# Altium schematic sheet Microcontroller.SchDoc
size A2; Organization: Altium Limited; Address1: L3, 12a Rodborough Rd; Address2: Frenchs Forest; Address3: NSW; Address4: Australia 2086
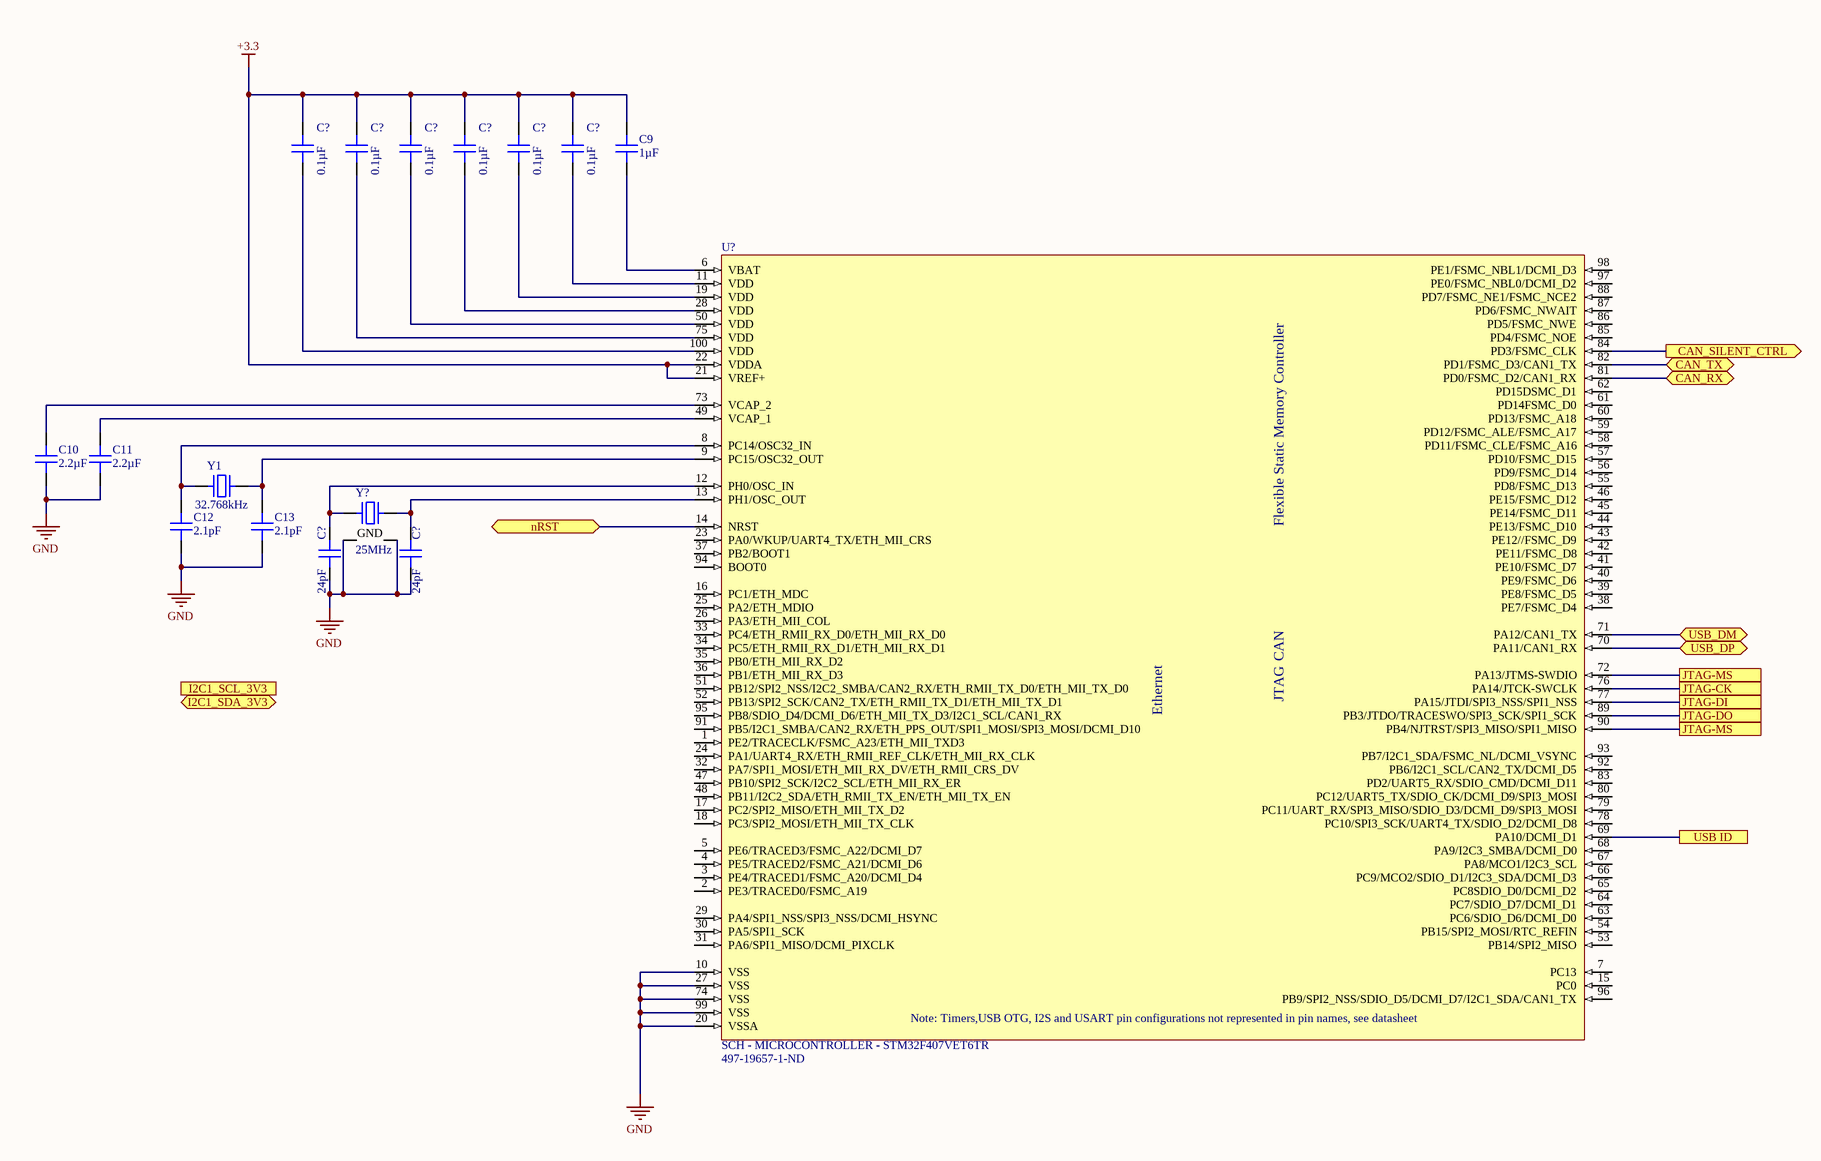
[diagram p0: Microcontroller.SchDoc]

## Parts
(Parts that share a designator on the sheet are numbered #1, #2 ... from top to bottom, then left to right.)
C9  1µF  [CAP 0603_1608]
C10  2.2µF  [CAP 0603_1608]
C11  2.2µF  [CAP 0603_1608]
C12  2.1pF  [CAP 0603_1608]
C13  2.1pF  [CAP 0603_1608]
C?#1  0.1µF  [CAP 0603_1608]
C?#2  0.1µF  [CAP 0603_1608]
C?#3  0.1µF  [CAP 0603_1608]
C?#4  0.1µF  [CAP 0603_1608]
C?#5  0.1µF  [CAP 0603_1608]
C?#6  0.1µF  [CAP 0603_1608]
C?#7  24pF  [CAP 0603_1608]
C?#8  24pF  [CAP 0603_1608]
U?  SCH - MICROCONTROLLER - STM32F407VET6TR  Supplier Part Number 1: 497-19657-1-ND  [PCB - LEADLESS - QFP - ST LQFP-100 14X14MM]
Y1  32.768kHz  [ABRACON ABS07]
Y?  25MHz  [EPSON TSX-3225]

## Ports
CAN_RX (bidir), CAN_SILENT_CTRL (out), CAN_TX (bidir), I2C1_SCL_3V3 (in), I2C1_SDA_3V3 (bidir), JTAG-CK, JTAG-DI, JTAG-DO, JTAG-MS, nRST (bidir), USB ID, USB_DM (bidir), USB_DP (bidir)

## Nets
+3.3: C9.2 C?#1.2 C?#2.2 C?#3.2 C?#4.2 C?#5.2 C?#6.2 U?.21(VREF+) U?.22(VDDA)
GND: C10.1 C11.1 C12.1 C13.1 C?#7.1 C?#8.1 U?.10(VSS) U?.20(VSSA) U?.27(VSS) U?.74(VSS) U?.99(VSS) Y?.2(GND) Y?.4(GND)
CAN_RX: U?.81(PD0/FSMC_D2/CAN1_RX) ; port CAN_RX
CAN_SILENT_CTRL: U?.84(PD3/FSMC_CLK) ; port CAN_SILENT_CTRL
CAN_TX: U?.82(PD1/FSMC_D3/CAN1_TX) ; port CAN_TX
JTAG-CK: U?.76(PA14/JTCK-SWCLK) ; port JTAG-CK
JTAG-DI: U?.77(PA15/JTDI/SPI3_NSS/SPI1_NSS) ; port JTAG-DI
JTAG-DO: U?.89(PB3/JTDO/TRACESWO/SPI3_SCK/SPI1_SCK) ; port JTAG-DO
JTAG-MS: U?.72(PA13/JTMS-SWDIO) U?.90(PB4/NJTRST/SPI3_MISO/SPI1_MISO) ; port JTAG-MS
nRST: U?.14(NRST) ; port nRST
USB ID: U?.69(PA10/DCMI_D1) ; port USB ID
USB_DM: U?.71(PA12/CAN1_TX) ; port USB_DM
USB_DP: U?.70(PA11/CAN1_RX) ; port USB_DP
NetC9_1: C9.1 U?.6(VBAT)
NetC10_2: C10.2 U?.73(VCAP_2)
NetC11_2: C11.2 U?.49(VCAP_1)
NetC12_2: C12.2 U?.8(PC14/OSC32_IN) Y1.1
NetC13_2: C13.2 U?.9(PC15/OSC32_OUT) Y1.2
NetC?#1_1: C?#1.1 U?.100(VDD)
NetC?#2_1: C?#2.1 U?.75(VDD)
NetC?#3_1: C?#3.1 U?.50(VDD)
NetC?#4_1: C?#4.1 U?.28(VDD)
NetC?#5_1: C?#5.1 U?.19(VDD)
NetC?#6_1: C?#6.1 U?.11(VDD)
NetC?#7_2: C?#7.2 U?.12(PH0/OSC_IN) Y?.1
NetC?#8_2: C?#8.2 U?.13(PH1/OSC_OUT) Y?.3

Not connected (* = marked no-connect by the designer): U? 1(PE2/TRACECLK/FSMC_A23/ETH_MII_TXD3) 2(PE3/TRACED0/FSMC_A19) 3(PE4/TRACED1/FSMC_A20/DCMI_D4) 4(PE5/TRACED2/FSMC_A21/DCMI_D6) 5(PE6/TRACED3/FSMC_A22/DCMI_D7) 7(PC13) 15(PC0) 16(PC1/ETH_MDC) 17(PC2/SPI2_MISO/ETH_MII_TX_D2) 18(PC3/SPI2_MOSI/ETH_MII_TX_CLK) 23(PA0/WKUP/UART4_TX/ETH_MII_CRS) 24(PA1/UART4_RX/ETH_RMII_REF_CLK/ETH_MII_RX_CLK) 25(PA2/ETH_MDIO) 26(PA3/ETH_MII_COL) 29(PA4/SPI1_NSS/SPI3_NSS/DCMI_HSYNC) 30(PA5/SPI1_SCK) 31(PA6/SPI1_MISO/DCMI_PIXCLK) 32(PA7/SPI1_MOSI/ETH_MII_RX_DV/ETH_RMII_CRS_DV) 33(PC4/ETH_RMII_RX_D0/ETH_MII_RX_D0) 34(PC5/ETH_RMII_RX_D1/ETH_MII_RX_D1) 35(PB0/ETH_MII_RX_D2) 36(PB1/ETH_MII_RX_D3) 37(PB2/BOOT1) 38(PE7/FSMC_D4) 39(PE8/FSMC_D5) 40(PE9/FSMC_D6) 41(PE10/FSMC_D7) 42(PE11/FSMC_D8) 43(PE12//FSMC_D9) 44(PE13/FSMC_D10) 45(PE14/FSMC_D11) 46(PE15/FSMC_D12) 47(PB10/SPI2_SCK/I2C2_SCL/ETH_MII_RX_ER) 48(PB11/I2C2_SDA/ETH_RMII_TX_EN/ETH_MII_TX_EN) 51(PB12/SPI2_NSS/I2C2_SMBA/CAN2_RX/ETH_RMII_TX_D0/ETH_MII_TX_D0) 52(PB13/SPI2_SCK/CAN2_TX/ETH_RMII_TX_D1/ETH_MII_TX_D1) 53(PB14/SPI2_MISO) 54(PB15/SPI2_MOSI/RTC_REFIN) 55(PD8/FSMC_D13) 56(PD9/FSMC_D14) 57(PD10/FSMC_D15) 58(PD11/FSMC_CLE/FSMC_A16) 59(PD12/FSMC_ALE/FSMC_A17) 60(PD13/FSMC_A18) 61(PD14FSMC_D0) 62(PD15DSMC_D1) 63(PC6/SDIO_D6/DCMI_D0) 64(PC7/SDIO_D7/DCMI_D1) 65(PC8SDIO_D0/DCMI_D2) 66(PC9/MCO2/SDIO_D1/I2C3_SDA/DCMI_D3) 67(PA8/MCO1/I2C3_SCL) 68(PA9/I2C3_SMBA/DCMI_D0) 78(PC10/SPI3_SCK/UART4_TX/SDIO_D2/DCMI_D8) 79(PC11/UART_RX/SPI3_MISO/SDIO_D3/DCMI_D9/SPI3_MOSI) 80(PC12/UART5_TX/SDIO_CK/DCMI_D9/SPI3_MOSI) 83(PD2/UART5_RX/SDIO_CMD/DCMI_D11) 85(PD4/FSMC_NOE) 86(PD5/FSMC_NWE) 87(PD6/FSMC_NWAIT) 88(PD7/FSMC_NE1/FSMC_NCE2) 91(PB5/I2C1_SMBA/CAN2_RX/ETH_PPS_OUT/SPI1_MOSI/SPI3_MOSI/DCMI_D10) 92(PB6/I2C1_SCL/CAN2_TX/DCMI_D5) 93(PB7/I2C1_SDA/FSMC_NL/DCMI_VSYNC) 94(BOOT0) 95(PB8/SDIO_D4/DCMI_D6/ETH_MII_TX_D3/I2C1_SCL/CAN1_RX) 96(PB9/SPI2_NSS/SDIO_D5/DCMI_D7/I2C1_SDA/CAN1_TX) 97(PE0/FSMC_NBL0/DCMI_D2) 98(PE1/FSMC_NBL1/DCMI_D3)

## Notes on the sheet
- Title
- Size:
- Date:
- File:
- A2
- Number:
- Time:
- Revision:
- Sheet
- of
- (in symbol SCH - MICROCONTROLLER - STM32F407VET6TR) Flexible Static Memory Controller; CAN; JTAG; Ethernet; Note: Timers,USB OTG, I2S and USART pin configurations not represented in pin names, see datasheet

## Library data of the parts
C9 = GCM188R71C105KA64J: CAP CER 1UF 16V X7R 0603; Manufacturer: Murata Electronics; Tolerance: ±10%; Part Number: GCM188R71C105KA64J; Value: 1µF; Applications: Automotive; Capacitance: 1µF; ComponentLink1Description: Datasheet; ComponentLink1URL: https://www.murata.com/~/media/webrenewal/support/library/catalog/products/capacitor/mlcc/c03e.ashx?la=en-us; ComponentLink2Description: DigiKey Link; ComponentLink2URL: http://digikey.com/product-detail/en/murata-electronics/GCM188R71C105KA64J/490-12657-1-ND/5797626; Device Package: 0603 (1608 Metric); LastUpdated: 9/2/2020 1:03:14 AM; Lifecycle Status: Active; Minimum Order: 1; Mounting Type: Surface Mount, MLCC; Operating Temperature: -55°C ~ 125°C; Package / Case: 0603 (1608 Metric); Packaging: TapeAndReel; PartId: 13992; Part Status: Active; Price: 0.03; Ratings: AEC-Q200; Series: GCM; Size / Dimension: 0.063" L x 0.031" W (1.60mm x 0.80mm); Supplier 1: DigiKey; Supplier Part Number 1: 490-12657-1-ND; Temperature Coefficient: X7R; Thickness (Max): 0.035" (0.90mm); Voltage - Rated: 16V
C10 C11 = EMK107BJ225KA-T: CAP CER 2.2UF 16V X5R 0603; Manufacturer: Taiyo Yuden; Tolerance: ±10%; Part Number: EMK107BJ225KA-T; Value: 2.2µF; Applications: General Purpose; Capacitance: 2.2µF; ComponentLink1Description: Datasheet; ComponentLink1URL: https://ds.yuden.co.jp/TYCOMPAS/ut/detail?pn=EMK107BJ225KA-T  &u=M; ComponentLink2Description: DigiKey Link; ComponentLink2URL: http://digikey.com/product-detail/en/taiyo-yuden/EMK107BJ225KA-T/587-1430-1-ND/1004061; Device Package: 0603 (1608 Metric); LastUpdated: 9/2/2020 1:03:30 AM; Lifecycle Status: Active; Minimum Order: 1; Mounting Type: Surface Mount, MLCC; Operating Temperature: -55°C ~ 85°C; Package / Case: 0603 (1608 Metric); Packaging: TapeAndReel; PartId: 5619; Part Status: Active; Price: 0.02; Series: M; Size / Dimension: 0.063" L x 0.031" W (1.60mm x 0.80mm); Supplier 1: DigiKey; Supplier Part Number 1: 587-1430-1-ND; Temperature Coefficient: X5R; Thickness (Max): 0.035" (0.90mm); Voltage - Rated: 16V
C12 C13 = CBR06C219B5GAC: CAP CER RF 2.1PF 50V +/-0.1 PF C; Manufacturer: KEMET; Temperature Coefficient: C0G, NP0; Tolerance: ±0.1pF; Part Number: CBR06C219B5GAC; Value: 2.1pF; Applications: RF, Microwave, High Frequency; Capacitance: 2.1pF; ComponentLink1Description: Datasheet; ComponentLink1URL: https://api.kemet.com/component-edge/download/datasheet/CBR06C219B5GAC.pdf; ComponentLink2Description: DigiKey Link; ComponentLink2URL: http://digikey.com/product-detail/en/kemet/CBR06C219B5GAC/399-16153-1-ND/7649738; Device Package: 0603 (1608 Metric); Features: High Q, Low Loss, Ultra Low ESR; LastUpdated: 9/2/2020 1:03:15 AM; Lifecycle Status: Active; Minimum Order: 1; Mounting Type: Surface Mount, MLCC; Operating Temperature: -55°C ~ 125°C; Package / Case: 0603 (1608 Metric); Packaging: TapeAndReel; PartId: 13663; Part Status: Active; Price: 0.05; Series: CBR-SMD RF C0G; Size / Dimension: 0.063" L x 0.031" W (1.60mm x 0.80mm); Supplier 1: DigiKey; Supplier Part Number 1: 399-16153-1-ND; Thickness (Max): 0.034" (0.87mm); Voltage - Rated: 50V
C?#1-C?#6 = CL10B104KA8WPNC: CAP CER 0.1UF 25V X7R 0603; Manufacturer: Samsung Electro-Mechanics; Tolerance: ±10%; Part Number: CL10B104KA8WPNC; Value: 0.1µF; Applications: Automotive; Capacitance: 0.1µF; ComponentLink1Description: Datasheet; ComponentLink1URL: http://www.samsungsem.com/kr/support/product-search/mlcc/CL10B104KA8WPNC.jsp; ComponentLink2Description: DigiKey Link; ComponentLink2URL: http://digikey.com/product-detail/en/samsung-electro-mechanics/CL10B104KA8WPNC/1276-6717-1-ND/5961576; Device Package: 0603 (1608 Metric); Features: Open Mode; LastUpdated: 9/2/2020 1:03:30 AM; Lifecycle Status: Active; Minimum Order: 1; Mounting Type: Surface Mount, MLCC; Operating Temperature: -55°C ~ 125°C; Package / Case: 0603 (1608 Metric); Packaging: TapeAndReel; PartId: 5631; Part Status: Active; Price: 0.02; Ratings: AEC-Q200; Series: CL; Size / Dimension: 0.063" L x 0.031" W (1.60mm x 0.80mm); Supplier 1: DigiKey; Supplier Part Number 1: 1276-6717-1-ND; Temperature Coefficient: X7R; Thickness (Max): 0.035" (0.90mm); Voltage - Rated: 25V
C?#7 C?#8 = CL10C240JB8NNNC: CAP CER 24PF 50V C0G/NP0 0603; Manufacturer: Samsung Electro-Mechanics; Temperature Coefficient: C0G, NP0; Tolerance: ±5%; Part Number: CL10C240JB8NNNC; Value: 24pF; Applications: General Purpose; Capacitance: 24pF; ComponentLink1Description: Datasheet; ComponentLink1URL: http://www.samsungsem.com/kr/support/product-search/mlcc/CL10C240JB8NNNC.jsp; ComponentLink2Description: DigiKey Link; ComponentLink2URL: http://digikey.com/product-detail/en/samsung-electro-mechanics/CL10C240JB8NNNC/1276-1761-1-ND/3889847; Device Package: 0603 (1608 Metric); LastUpdated: 9/2/2020 1:03:22 AM; Lifecycle Status: Active; Minimum Order: 1; Mounting Type: Surface Mount, MLCC; Operating Temperature: -55°C ~ 125°C; Package / Case: 0603 (1608 Metric); Packaging: TapeAndReel; PartId: 10003; Part Status: Active; Price: 0.01; Series: CL; Size / Dimension: 0.063" L x 0.031" W (1.60mm x 0.80mm); Supplier 1: DigiKey; Supplier Part Number 1: 1276-1761-1-ND; Thickness (Max): 0.035" (0.90mm); Voltage - Rated: 50V
Y1 = ABS07-166-32.768KHZ-T: IOT 32.786KHZ XTAL; Manufacturer: Abracon LLC; ESR (Equivalent Series Resistance): 70 kOhms; Frequency Tolerance: ±10ppm; Load Capacitance: 7pF; Operating Mode: Fundamental; Part Number: ABS07-166-32.768KHZ-T; ComponentLink1Description: Datasheet; ComponentLink1URL: https://abracon.com/datasheets/ABS07-166-32.768kHz-T.pdf; ComponentLink2Description: DigiKey Link; ComponentLink2URL: http://digikey.com/product-detail/en/abracon-llc/ABS07-166-32.768KHZ-T/535-14514-1-ND/8827205; Frequency: 32.768kHz; Height - Seated (Max): 0.035" (0.90mm); LastUpdated: 9/2/2020 1:21:47 AM; Lifecycle Status: Active; Minimum Order: 1; Mounting Type: Surface Mount; Operating Temperature: -40°C ~ 85°C; Package / Case: 2-SMD, No Lead; Packaging: TapeAndReel; PartId: 384; Part Status: Active; Price: 0.35; Series: ABS07; Size / Dimension: 0.126" L x 0.059" W (3.20mm x 1.50mm); Supplier 1: DigiKey; Supplier Part Number 1: 535-14514-1-ND; Type: kHz Crystal (Tuning Fork); Value: 32.768kHz
Y? = TSX-3225 25.0000MF20P-C0: CRYSTAL 25.0000MHZ 18PF SMD; Manufacturer: EPSON; ESR (Equivalent Series Resistance): 40 Ohms; Frequency Stability: ±20ppm; Frequency Tolerance: ±10ppm; Operating Mode: Fundamental; Part Number: TSX-3225 25.0000MF20P-C0; ComponentLink1Description: Datasheet; ComponentLink1URL: https://support.epson.biz/td/api/doc_check.php?dl=brief_TSX-3225&lang=en; ComponentLink2Description: DigiKey Link; ComponentLink2URL: http://digikey.com/product-detail/en/epson/TSX-3225-25.0000MF20P-C0/SER4212CT-ND/7430967; Frequency: 25MHz; Height - Seated (Max): 0.024" (0.60mm); LastUpdated: 9/2/2020 1:21:54 AM; Lifecycle Status: Active; Load Capacitance: 18pF; Minimum Order: 1; Mounting Type: Surface Mount; Operating Temperature: -20°C ~ 85°C; Package / Case: 4-SMD, No Lead; Packaging: TapeAndReel; PartId: 447; Part Status: Active; Price: 0.18; Series: TSX-3225; Size / Dimension: 0.126" L x 0.098" W (3.20mm x 2.50mm); Supplier 1: DigiKey; Supplier Part Number 1: SER4212CT-ND; Type: MHz Crystal; Value: 25MHz
U? = SCH - MICROCONTROLLER - STM32F407VET6TR: Supplier 1: Digi-Key